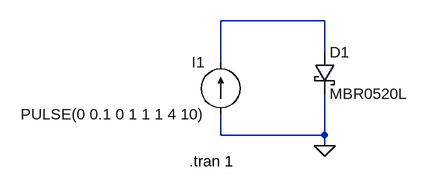
[diagram p0: schematic diode-tester.asc]
diode-tester.asc, the LTspice schematic file:
Version 4
SHEET 1 880 680
WIRE 192 64 32 64
WIRE 192 112 192 64
WIRE 32 128 32 64
WIRE 32 240 32 208
WIRE 192 240 192 176
WIRE 192 240 32 240
WIRE 192 256 192 240
FLAG 192 256 0
SYMBOL schottky 176 112 R0
SYMATTR InstName D1
SYMATTR Value MBR0520L
SYMATTR Description Diode
SYMATTR Type diode
SYMBOL current 32 208 R180
WINDOW 0 24 80 Left 2
WINDOW 3 24 0 Left 2
WINDOW 123 0 0 Left 0
WINDOW 39 0 0 Left 0
SYMATTR InstName I1
SYMATTR Value PULSE(0 0.1 0 1 1 1 4 10)
TEXT -16 280 Left 2 !.tran 1

The netlist it stands for:
* diode-tester.asc
D1 N001 0 MBR0520L
I1 0 N001 PULSE(0 0.1 0 1 1 1 4 10)
.model D D
.lib standard.dio
.tran 1
.backanno
.end